# Altium schematic sheet RadEnhanced.SchDoc
size 558 x 431 mm; SheetNumber: 5; SheetTotal: 9
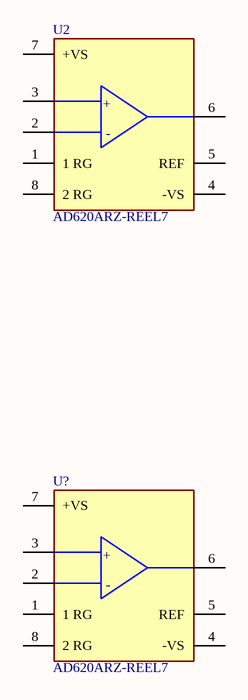
[diagram p0: RadEnhanced.SchDoc]

## Parts
U2  AD620ARZ-REEL7  [FP-R-8-IPC_C]
U?  AD620ARZ-REEL7  [FP-R-8-IPC_C]

## Nets

Not connected (* = marked no-connect by the designer): U2 1(1_RG) 2(-IN) 3(+IN) 4(-VS) 5(REF) 6(OUTPUT) 7(+VS) 8(2_RG); U? 1(1_RG) 2(-IN) 3(+IN) 4(-VS) 5(REF) 6(OUTPUT) 7(+VS) 8(2_RG)

## Notes on the sheet
- DWG. NO.
- REV.
- SHT.
- REVISION
- DESCRIPTION
- DATE
- APPROVED
- THIS DOCUMENT AND THE DATA DISCLOSED HEREIN OR HEREWITH IS THE PROPERTY OF ALTIUM LIMITED AND MAY BE FREELY DISTRIBUTED IN WHOLE. NO RIGHTS ARE RESERVED OR EXPRESS OR IMPLIED WARANTEE GIVEN.
- PROJECT
- TITLE
- SCALE:
- C
- SIZE
- CAGE CODE
- FILE NAME
- DWG by:
- Heitor Sampaio Mendes
- SHEET
- OF
- REV
- (in symbol CMP-09116-000354-1) +

## Library data of the parts
U2 U? = CMP-09116-000354-1: IC INST AMP 1 CIRCUIT 8SOIC; Input Resistance: 10GR; Bandwidth: 800kHz; Dual Supply Voltage: 15V; Number of Channels: 1; Power Dissipation: 650mW; Input Bias Current: 500pA; Common Mode Rejection Ratio: 93dB; Slew Rate: 1.2V/µs; Supply Current: 900uA; Input Offset Voltage (Vos): 30mV; Min Dual Supply Voltage: 2.3V; Min Supply Voltage: 4.6V; Power Supply Rejection Ratio (PSRR): 140dB; Operating Supply Voltage: 18V; Output Current per Channel: 18mA; -3db Bandwidth: 1MHz; Operating Supply Current: 1.3mA; Mount: Surface Mount; RoHS Compliant: Yes; Max Operating Temperature: 125°C; Radiation Hardening: No; Packaging: Tape and Reel; Nominal Supply Current: 900uA; Contact Plating: Tin; Number of Elements: 1; Number of Circuits: 1; Series: -; Case/Package: SOIC; Package Quantity: 1; Max Dual Supply Voltage: 18V; Min Operating Temperature: -55°C; Lead Free: Contains Lead; Number of Pins: 8; Max Power Dissipation: 650mW